# Altium schematic sheet CAN.SchDoc
size A4
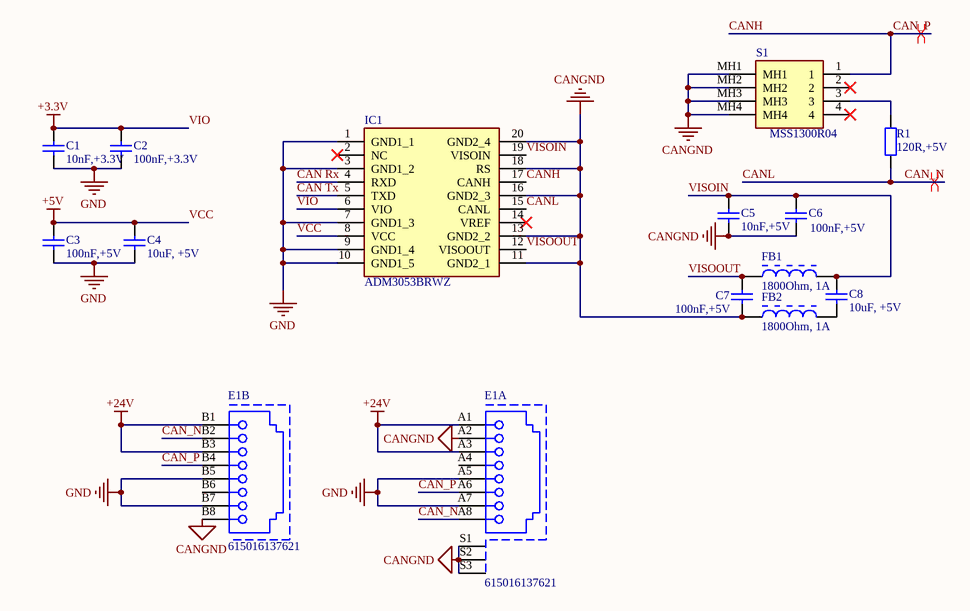
[diagram p0: CAN.SchDoc]

## Parts
C1  10nF,+3.3V  [C 0805]
C2  100nF,+3.3V  [C 1206]
C3  100nF,+5V  [C 1206]
C4  10uF, +5V  [C 1206]
C5  10nF,+5V  [C 0805]
C6  100nF,+5V  [C 1206]
C7  100nF,+5V  [C 1206]
C8  10uF, +5V  [C 1206]
E1  615016137621  [Ethernet2]  (parts A,B of 2)
FB1  1800Ohm, 1A  [F 0805]
FB2  1800Ohm, 1A  [F 0805]
IC1  ADM3053BRWZ  [SOIC127P1032X265-20N]
R1  120R,+5V  [R 0805]
S1  MSS1300R04  [MSS1300R04]

## Nets
+24V: E1.A1 E1.A3 E1.B1 E1.B3
CANGND: C5.1 C6.1 C7.1 E1.A2 E1.B8 E1.S1 E1.S2 E1.S3 FB2.1 IC1.11(GND2_1) IC1.13(GND2_2) IC1.16(GND2_3) IC1.18(RS) IC1.20(GND2_4) S1.MH1 S1.MH2 S1.MH3 S1.MH4
GND: C1.1 C2.1 C3.1 C4.1 E1.A5 E1.A7 E1.B5 E1.B7 IC1.1(GND1_1) IC1.3(GND1_2) IC1.7(GND1_3) IC1.9(GND1_4) IC1.10(GND1_5)
VCC: C3.2 C4.2 IC1.8(VCC)  [also labelled +5V]
VIO: C1.2 C2.2 IC1.6(VIO)  [also labelled +3.3V]
CAN Rx: IC1.4(RXD)
CAN Tx: IC1.5(TXD)
CAN_N: E1.A8 E1.B2 IC1.15(CANL) R1.1  [also labelled CANL]
CAN_P: E1.A6 E1.B4 IC1.17(CANH) S1.1  [also labelled CANH]
VISOIN: C5.2 C6.2 C8.2 FB1.2 IC1.19(VISOIN)
VISOOUT: C7.2 FB1.1 IC1.12(VISOOUT)
NetC8_1: C8.1 FB2.2
NetR1_2: R1.2 S1.3

Not connected (* = marked no-connect by the designer): E1 A4 B6; IC1 2(NC)* 14(VREF)*; S1 2* 4*

## Layout directives
differential pair: CAN_N, CAN_P

## Library data of the parts
C1 C5 = 885012207126_6: WCAP-CSGP Multilayer Ceramic Chip Capacitor, General Purpose, size 0805, X7R, 47nF, 100V; Manufacturer: Wurth Elektronik; Rated Voltage: 100VDC; Isolation Resistance: >=2.1GOhm; Capacitance Tolerance: +/-10%; Technical Reference: X7R0805473K100DFCT10000; ComponentLink1Description: Manufacturer; ComponentLink1URL: http://www.we-online.de; ComponentLink2Description: Datasheet; ComponentLink2URL: https://www.we-online.com/catalog/datasheet/885012207126.pdf; Operating Temperature: -55 to +125degC; Packaging: Tape and Reel; Manufacturer Part Number: 885012207126; Published Date: May 2020; Ceramic Type: X7R; Dissipation Factor: =<2.5%; Height: 1.25mm; Mounting Technology: SMT; Size: 0805; Capacitance: 47nF
C2 = 885012208015_1: WCAP-CSGP General Purpose Ceramic Capacitors, size 1206, 2.2uF, +/-10%, 10VDC; Isolation Resistance: >=0.2GOhm; Ceramic Type: X7R; Technical Reference: X7R1206225K010DFCT10000; ComponentLink1Description: Manufacturer; ComponentLink1URL: http://www.we-online.de; ComponentLink2Description: Datasheet; ComponentLink2URL: https://katalog.we-online.com/pbs/datasheet/885012208015.pdf; Operating Temperature: -55 to +125degC; Packaging: Tape and Reel; Part Number: 885012208015; Publisher: Wurth Elektronik; Rated Voltage: 10VDC; Published Date: August 2019; Capacitance Tolerance: +/-10%; Dissipation Factor: =<10%; Height: 1.15mm +/-0.15mm; Mounting Technology: SMT; Size: 1206; Capacitance: 2.2uF
C3 C6 C7 = 885012208013_4: WCAP-CSGP General Purpose Ceramic Capacitors, size 1206, 1uF, +/-10%, 10VDC; Isolation Resistance: >=0.5GOhm; Ceramic Type: X7R; Technical Reference: X7R1206105K010DFCT10000; ComponentLink1Description: Manufacturer; ComponentLink1URL: http://www.we-online.de; ComponentLink2Description: Datasheet; ComponentLink2URL: https://katalog.we-online.com/pbs/datasheet/885012208013.pdf; Operating Temperature: -55 to +125degC; Packaging: Tape and Reel; Part Number: 885012208013; Publisher: Wurth Elektronik; Rated Voltage: 10VDC; Published Date: August 2019; Capacitance Tolerance: +/-10%; Dissipation Factor: =<5%; Height: 1.15mm +/-0.15mm; Mounting Technology: SMT; Size: 1206; Capacitance: 1uF
C4 C8 = 885012208013_5: WCAP-CSGP General Purpose Ceramic Capacitors, size 1206, 1uF, +/-10%, 10VDC; Isolation Resistance: >=0.5GOhm; Ceramic Type: X7R; Technical Reference: X7R1206105K010DFCT10000; ComponentLink1Description: Manufacturer; ComponentLink1URL: http://www.we-online.de; ComponentLink2Description: Datasheet; ComponentLink2URL: https://katalog.we-online.com/pbs/datasheet/885012208013.pdf; Operating Temperature: -55 to +125degC; Packaging: Tape and Reel; Part Number: 885012208013; Publisher: Wurth Elektronik; Rated Voltage: 10VDC; Published Date: August 2019; Capacitance Tolerance: +/-10%; Dissipation Factor: =<5%; Height: 1.15mm +/-0.15mm; Mounting Technology: SMT; Size: 1206; Capacitance: 1uF
E1 = 615016137621: WR-MJ Modular Jack THT Horizontal Shielded Dual Port 8P8C Tab Down; Rated Current: 1.5A; Contact Resistance: 20mOhm; Insulation Resistance: 500MOhm; Working Voltage: 120VAC; Withstanding Voltage: 1000VAC; ComponentLink1Description: Manufacturer; ComponentLink1URL: http://www.we-online.de; ComponentLink2Description: Datasheet; ComponentLink2URL: https://katalog.we-online.com/em/datasheet/615016137621.pdf; Packaging: Tray; Publisher: Wurth Elektronik; Mounting Technology: THT; Operating Temperature: -40 to +85degC; Part Number: 615016137621; Published Date: November 2019; xPxC: 8P8C; Type: Horizontal
FB1 FB2 = 742792090: WE-CBF SMT EMI Suppression Ferrite Bead, size 0805, 1800Ohm, 1A; Manufacturer: Wurth Elektronik; Impedance max.: 2000Ohm; DC Resistance max.: 0.4Ohm; Type: Wide Band; ComponentLink1Description: Manufacturer; ComponentLink1URL: http://www.we-online.de; ComponentLink2Description: Datasheet; ComponentLink2URL: https://www.we-online.com/catalog/datasheet/742792090.pdf; Operating Temperature: -55 to +125degC; Packaging: Tape and Reel; Published Date: March 2020; Rated Current: 1A; Manufacturer Part Number: 742792090; Impedance @100MHz: 1800Ohm; Mounting Technology: SMT; Size: 0805
IC1 = ADM3053BRWZ: Integrated Circuit; Manufacturer_Name: Analog Devices; Datasheet Link: https://componentsearchengine.com/Datasheets/2/ADM3053BRWZ.pdf; Height: 2.65mm; Manufacturer_Part_Number: ADM3053BRWZ; Mouser Part Number: 584-ADM3053BRWZ; Mouser Price/Stock: https://www.mouser.co.uk/ProductDetail/Analog-Devices/ADM3053BRWZ?qs=BpaRKvA4VqGZYG1hZ9cdqw%3D%3D; Arrow Part Number: ADM3053BRWZ; Arrow Price/Stock: https://www.arrow.com/en/products/adm3053brwz/analog-devices?region=nac
R1 = 560050320011_9: WRIS-KSKE SMT Thick Film Resistor, size 0805, 1Ohm, 0.33W; Manufacturer: Wurth Elektronik; Rated Current: 0.57A; Temperature Coefficient of Resistance: +/-100ppm/degC; Technical Reference: KE08051R00F103KAATP0000; Resistance Tolerance: +/-1%; ComponentLink1Description: Manufacturer; ComponentLink1URL: http://www.we-online.de; ComponentLink2Description: Datasheet; ComponentLink2URL: https://www.we-online.com/catalog/datasheet/560050320011.pdf; Published Date: May 2020; Rated Power: 0.33W; Resistance: 1Ohm; Height: 0.6mm; Operating Temperature: -55 to +155degC; Mounting Technology: SMT; Packaging: Tape and Reel; Size: 0805; Length: 2mm; Manufacturer Part Number: 560050320011; Width: 1.25mm
S1 = MSS1300R04: Switch; Manufacturer_Name: TE Connectivity; Datasheet Link: https://www.te.com/commerce/DocumentDelivery/DDEController?Action=showdoc&DocId=Customer+Drawing%7F1825260%7FA2%7Fpdf%7FEnglish%7FENG_CD_1825260_A2.pdf%7F1825260-1; Height: 11.3mm; Manufacturer_Part_Number: MSS1300R04; Mouser Part Number: 506-MSS1300R04; Mouser Price/Stock: https://www.mouser.co.uk/ProductDetail/TE-Connectivity-PB/MSS1300R04?qs=Of7OaoM7rsFDfSerl70TPw%3D%3D